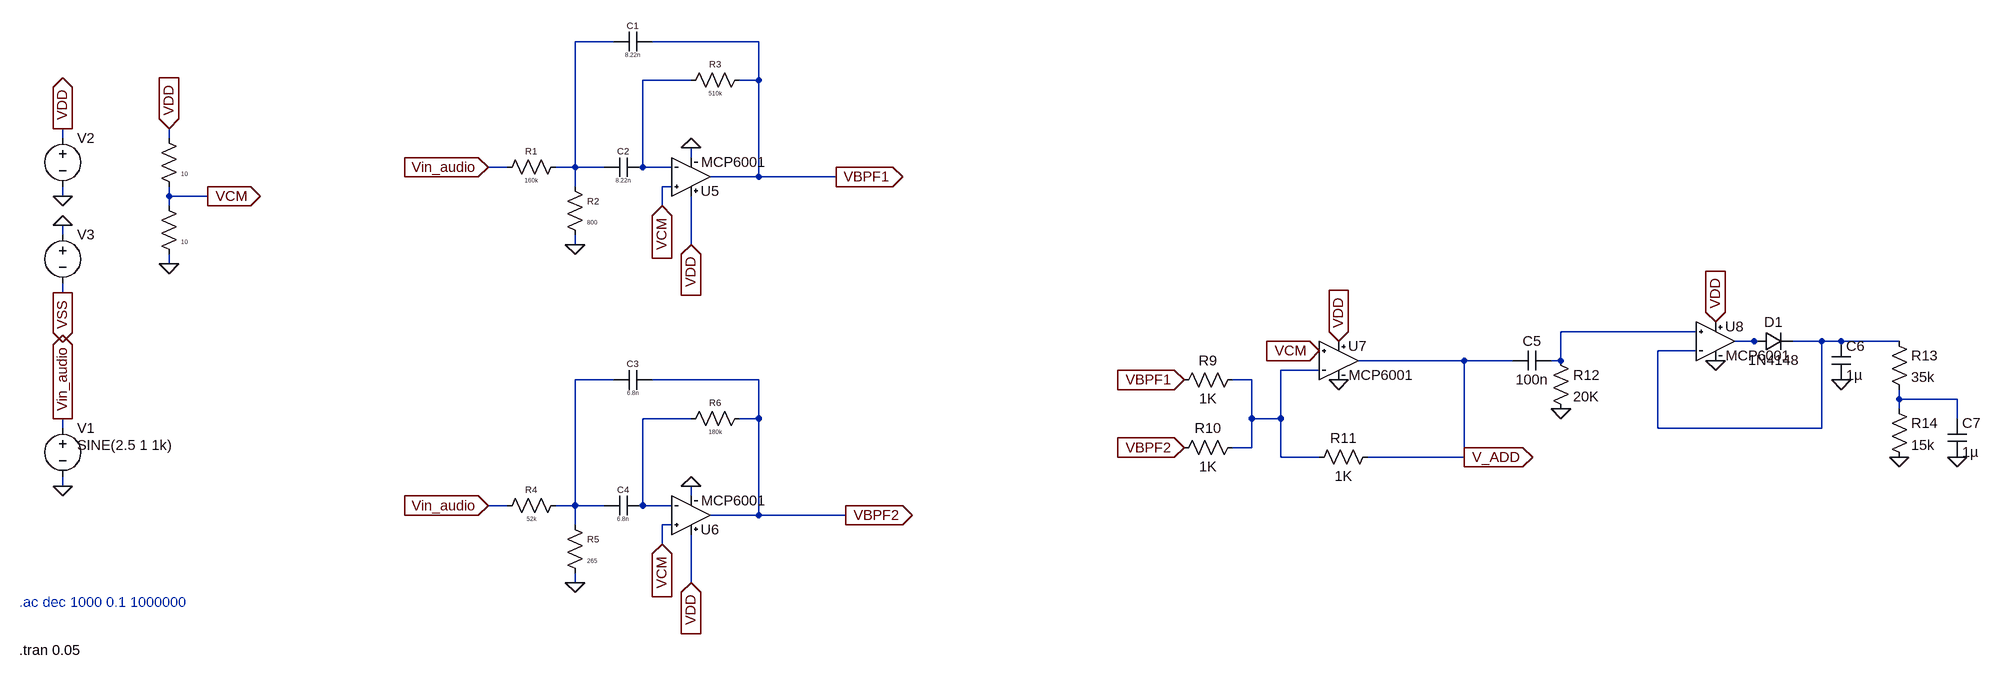
[diagram p0: schematic EXP7.asc]
EXP7.asc, the LTspice schematic file:
Version 4.1
SHEET 1 1776 864
WIRE -528 -160 -592 -160
WIRE -288 -160 -464 -160
WIRE -400 -96 -480 -96
WIRE -288 -96 -288 -160
WIRE -288 -96 -320 -96
WIRE -1440 0 -1440 -16
WIRE -1264 0 -1264 -16
WIRE -400 32 -400 16
WIRE -704 48 -736 48
WIRE -592 48 -592 -160
WIRE -592 48 -624 48
WIRE -544 48 -592 48
WIRE -480 48 -480 -96
WIRE -432 48 -480 48
WIRE -288 64 -288 -96
WIRE -288 64 -368 64
WIRE -160 64 -288 64
WIRE -592 80 -592 48
WIRE -432 80 -448 80
WIRE -1440 96 -1440 80
WIRE -1264 96 -1264 80
WIRE -1200 96 -1264 96
WIRE -1264 112 -1264 96
WIRE -448 112 -448 80
WIRE -1440 160 -1440 144
WIRE -592 176 -592 160
WIRE -400 176 -400 96
WIRE -1264 208 -1264 192
WIRE -1440 256 -1440 240
WIRE 1264 320 1040 320
WIRE 1360 336 1328 336
WIRE 1376 336 1360 336
WIRE 1472 336 1424 336
WIRE 1504 336 1472 336
WIRE 1600 336 1504 336
WIRE 1264 352 1200 352
WIRE 880 368 704 368
WIRE 960 368 880 368
WIRE 1040 368 1040 320
WIRE 1040 368 1024 368
WIRE 640 384 576 384
WIRE -528 400 -592 400
WIRE -288 400 -464 400
WIRE 528 400 496 400
WIRE 1600 432 1600 416
WIRE 1696 432 1600 432
WIRE 1600 448 1600 432
WIRE -400 464 -480 464
WIRE -288 464 -288 400
WIRE -288 464 -320 464
WIRE 528 464 528 400
WIRE 576 464 576 384
WIRE 576 464 528 464
WIRE 1696 464 1696 432
WIRE -1440 480 -1440 464
WIRE 1200 480 1200 352
WIRE 1472 480 1472 336
WIRE 1472 480 1200 480
WIRE 528 512 528 464
WIRE 528 512 496 512
WIRE 576 528 576 464
WIRE 640 528 576 528
WIRE 880 528 880 368
WIRE 880 528 720 528
WIRE -1440 576 -1440 560
WIRE -400 592 -400 576
WIRE -704 608 -736 608
WIRE -592 608 -592 400
WIRE -592 608 -624 608
WIRE -544 608 -592 608
WIRE -480 608 -480 464
WIRE -432 608 -480 608
WIRE -288 624 -288 464
WIRE -288 624 -368 624
WIRE -144 624 -288 624
WIRE -592 640 -592 608
WIRE -432 640 -448 640
WIRE -448 672 -448 640
WIRE -592 736 -592 720
WIRE -400 736 -400 656
FLAG -592 176 0
FLAG -736 48 Vin_audio
IOPIN -736 48 In
FLAG -1440 464 Vin_audio
IOPIN -1440 464 Out
FLAG -1440 576 0
FLAG -1440 96 0
FLAG -1440 -16 VDD
IOPIN -1440 -16 Out
FLAG -1440 144 0
FLAG -1440 256 VSS
IOPIN -1440 256 Out
FLAG -592 736 0
FLAG -736 608 Vin_audio
IOPIN -736 608 In
FLAG -1264 208 0
FLAG -1264 -16 VDD
IOPIN -1264 -16 In
FLAG -1200 96 VCM
IOPIN -1200 96 Out
FLAG -448 112 VCM
IOPIN -448 112 In
FLAG -448 672 VCM
IOPIN -448 672 In
FLAG -144 624 VBPF2
IOPIN -144 624 Out
FLAG -160 64 VBPF1
IOPIN -160 64 Out
FLAG 880 528 V_ADD
IOPIN 880 528 Out
FLAG 416 400 VBPF1
IOPIN 416 400 In
FLAG 416 512 VBPF2
IOPIN 416 512 In
FLAG 640 352 VCM
IOPIN 640 352 In
FLAG 1040 448 0
FLAG 1504 400 0
FLAG -400 576 0
FLAG -400 16 0
FLAG -400 176 VDD
IOPIN -400 176 In
FLAG -400 736 VDD
IOPIN -400 736 In
FLAG 672 400 0
FLAG 1296 368 0
FLAG 672 336 VDD
IOPIN 672 336 In
FLAG 1296 304 VDD
IOPIN 1296 304 In
FLAG 1600 528 0
FLAG 1696 528 0
SYMBOL res -608 32 R90
WINDOW 0 0 56 VBottom 1
WINDOW 3 32 56 VTop 0
SYMATTR InstName R1
SYMATTR Value 160k
SYMBOL res -608 64 R0
WINDOW 0 36 40 Left 1
WINDOW 3 36 76 Left 0
SYMATTR InstName R2
SYMATTR Value 800
SYMBOL res -416 -80 R270
WINDOW 0 32 56 VTop 1
WINDOW 3 0 56 VBottom 0
SYMATTR InstName R3
SYMATTR Value 510k
SYMBOL cap -464 -176 R90
WINDOW 0 0 32 VBottom 1
WINDOW 3 32 32 VTop 0
SYMATTR InstName C1
SYMATTR Value 8.22n
SYMBOL cap -480 32 R90
WINDOW 0 0 32 VBottom 1
WINDOW 3 32 32 VTop 0
SYMATTR InstName C2
SYMATTR Value 8.22n
SYMBOL voltage -1440 464 R0
WINDOW 3 24 44 Left 2
WINDOW 39 0 0 Left 0
WINDOW 123 24 72 Left 2
SYMATTR Value SINE(2.5 1 1k)
SYMATTR InstName V1
SYMBOL voltage -1440 -16 R0
WINDOW 3 24 96 Invisible 2
SYMATTR Value 5
SYMATTR InstName V2
SYMBOL voltage -1440 144 R0
WINDOW 3 24 96 Invisible 2
SYMATTR Value 5
SYMATTR InstName V3
SYMBOL res -608 592 R90
WINDOW 0 0 56 VBottom 1
WINDOW 3 32 56 VTop 0
SYMATTR InstName R4
SYMATTR Value 52k
SYMBOL res -608 624 R0
WINDOW 0 36 40 Left 1
WINDOW 3 36 76 Left 0
SYMATTR InstName R5
SYMATTR Value 265
SYMBOL res -416 480 R270
WINDOW 0 32 56 VTop 1
WINDOW 3 0 56 VBottom 0
SYMATTR InstName R6
SYMATTR Value 180k
SYMBOL cap -464 384 R90
WINDOW 0 0 32 VBottom 1
WINDOW 3 32 32 VTop 0
SYMATTR InstName C3
SYMATTR Value 6.8n
SYMBOL cap -480 592 R90
WINDOW 0 0 32 VBottom 1
WINDOW 3 32 32 VTop 0
SYMATTR InstName C4
SYMATTR Value 6.8n
SYMBOL res -1280 -16 R0
WINDOW 0 36 40 Invisible 2
WINDOW 3 36 76 Left 0
SYMATTR InstName R7
SYMATTR Value 10
SYMBOL res -1280 96 R0
WINDOW 0 36 40 Invisible 2
WINDOW 3 36 76 Left 0
SYMATTR InstName R8
SYMATTR Value 10
SYMBOL res 512 384 R90
WINDOW 0 0 56 VBottom 2
WINDOW 3 32 56 VTop 2
SYMATTR InstName R9
SYMATTR Value 1K
SYMBOL res 512 496 R90
WINDOW 0 0 56 VBottom 2
WINDOW 3 32 56 VTop 2
SYMATTR InstName R10
SYMATTR Value 1K
SYMBOL res 736 512 R90
WINDOW 0 0 56 VBottom 2
WINDOW 3 32 56 VTop 2
SYMATTR InstName R11
SYMATTR Value 1K
SYMBOL cap 1024 352 R90
WINDOW 0 0 32 VBottom 2
WINDOW 3 32 32 VTop 2
SYMATTR InstName C5
SYMATTR Value 100n
SYMBOL res 1024 352 R0
SYMATTR InstName R12
SYMATTR Value 20K
SYMBOL cap 1488 336 R0
SYMATTR InstName C6
SYMATTR Value 1µ
SYMBOL res 1584 320 R0
SYMATTR InstName R13
SYMATTR Value 35k
SYMBOL diode 1360 352 R270
WINDOW 0 32 32 VTop 2
WINDOW 3 0 32 VBottom 2
SYMATTR InstName D1
SYMATTR Value 1N4148
SYMBOL res 1584 432 R0
SYMATTR InstName R14
SYMATTR Value 15k
SYMBOL cap 1680 464 R0
SYMATTR InstName C7
SYMATTR Value 1µ
SYMBOL MCP6001 -400 64 M180
SYMATTR InstName U5
SYMBOL MCP6001 -400 624 M180
SYMATTR InstName U6
SYMBOL MCP6001 672 368 R0
SYMATTR InstName U7
SYMBOL MCP6001 1296 336 R0
SYMATTR InstName U8
TEXT -1512 848 Left 2 !.tran 0.05
TEXT -1512 768 Left 2 ;.ac dec 1000 0.1 1000000

The netlist it stands for:
* EXP7.asc
R1 N001 Vin_audio 160k
R2 N001 0 800
R3 N002 VBPF1 510k
C1 VBPF1 N001 8.22n
C2 N002 N001 8.22n
V1 Vin_audio 0 SINE(2.5 1 1k)
V2 VDD 0 5
V3 0 VSS 5
R4 N007 Vin_audio 52k
R5 N007 0 265
R6 N009 VBPF2 180k
C3 VBPF2 N007 6.8n
C4 N009 N007 6.8n
R7 VDD VCM 10
R8 VCM 0 10
R9 N006 VBPF1 1K
R10 N006 VBPF2 1K
R11 V_ADD N006 1K
C5 N003 V_ADD 100n
R12 N003 0 20K
C6 N005 0 1µ
R13 N005 N008 35k
D1 N004 N005 1N4148
R14 N008 0 15k
C7 N008 0 1µ
X§U5 VCM N002 VDD 0 VBPF1 MCP6001
X§U6 VCM N009 VDD 0 VBPF2 MCP6001
X§U7 VCM N006 VDD 0 V_ADD MCP6001
X§U8 N003 N005 VDD 0 N004 MCP6001
.model D D
.lib standard.dio
.tran 0.05
* .ac dec 1000 0.1 1000000
.lib C:\Users\Sripathi\Downloads\lab2\MCP6001.lib
.backanno
.end